# Altium project Ticket_Dispancer.PrjPcb (part 3 of 3)

## Sheet Power.SchDoc
size A4; SheetNumber: 7; SheetTotal: 8
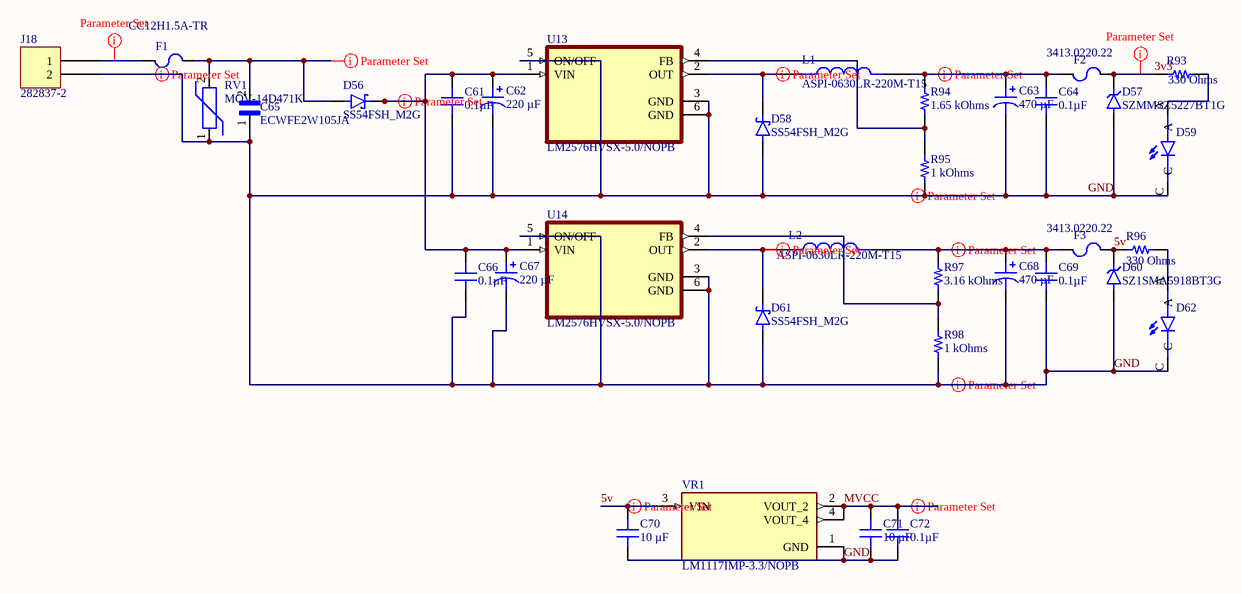
[diagram p6: Power.SchDoc]

### Parts
C61  Capacitance: 0.1µF  [CAP 0805_2012]  (hidden comment: 1µF)
C62  220 µF  [CAP ALSMD ELEC 8.3MM H11MM]
C63  470 µF  [CAP ALSMD 8.3MM H10.5MM]
C64  Capacitance: 0.1µF  [CAP 0805_2012]  (hidden comment: 1µF)
C65  ECWFE2W105JA  [CAPRR1500W80L1750T700H1250]
C66  Capacitance: 0.1µF  [CAP 0805_2012]  (hidden comment: 1µF)
C67  220 µF  [CAP ALSMD ELEC 8.3MM H11MM]
C68  470 µF  [CAP ALSMD 8.3MM H10.5MM]
C69  Capacitance: 0.1µF  [CAP 0805_2012]  (hidden comment: 1µF)
C70  10 µF  [MURATA CAP GRM31C 1206_3216]
C71  10 µF  [MURATA CAP GRM31C 1206_3216]
C72  Capacitance: 0.1µF  [CAP 0805_2012]  (hidden comment: 1µF)
D56  SS54FSH_M2G  [SODFL4725X110N]
D57  SZMMSZ5227BT1G  [DIO_SZMMSZ5227BT1G]
D58  SS54FSH_M2G  [SODFL4725X110N]
D59  597-3305-607F  [LEDC2012X70N]  (value not drawn)
D60  SZ1SMA5918BT3G  [DIOM5226X220N]
D61  SS54FSH_M2G  [SODFL4725X110N]
D62  597-3305-607F  [LEDC2012X70N]  (value not drawn)
F1  CC12H1.5A-TR  [FUSE 1206_3216 0.6MM]
F2  3413.0220.22  [FUSE 1206_3216 0.6MM]
F3  3413.0220.22  [FUSE 1206_3216 0.6MM]
J18  282837-2  [TE 282837-2]
L1  ASPI-0630LR-220M-T15  [IND_ASPI-0630LR-220M-T15]
L2  ASPI-0630LR-220M-T15  [IND_ASPI-0630LR-220M-T15]
R93  330 Ohms  [RES 0805_2012]
R94  1.65 kOhms  [RES 0805_2012]
R95  1 kOhms  [RES 0805_2012]
R96  330 Ohms  [RES 0805_2012]
R97  3.16 kOhms  [RES 0805_2012]
R98  1 kOhms  [RES 0805_2012]
RV1  MOV-14D471K  [MOV14D471K]
U13  LM2576HVSX-5.0/NOPB  [VREG_TPS79625KTTR]
U14  LM2576HVSX-5.0/NOPB  [VREG_TPS79625KTTR]
VR1  LM1117IMP-3.3/NOPB  [VREG_LM1117IMP-3.3/NOPB]

### Nets
3v3: D57.1(K) F2.2 R93.1
5v: C70.2 D60.C F3.2 R96.1 VR1.3(VIN)
GND: C61.1 C62.2 C63.2 C64.1 C65.1 C66.1 C67.2 C68.2 C69.1 C70.1 C71.1 C72.1 D57.2(A) D58.A D59.C D60.A D61.A D62.C J18.2 R95.2 R98.2 RV1.1 U13.3(GND) U13.5(ON/OFF) U13.6(GND) U14.3(GND) U14.5(ON/OFF) U14.6(GND) VR1.1(GND)
MVCC: C71.2 C72.2 VR1.2(VOUT_2) VR1.4(VOUT_4)
NetC61_2: C61.2 C62.1 C66.2 C67.1 D56.C(K) U13.1(VIN) U14.1(VIN)
NetC63_1: C63.1 C64.2 F2.1 L1.2 R94.1
NetC65_2: C65.2 D56.A F1.2 RV1.2
NetC68_1: C68.1 C69.2 F3.1 L2.2 R97.2
NetD58_C: D58.C(K) L1.1 U13.2(OUT)
NetD59_A: D59.A R93.2
NetD61_C: D61.C(K) L2.1 U14.2(OUT)
NetD62_A: D62.A R96.2
NetF1_1: F1.1 J18.1
NetR94_2: R94.2 R95.1 U13.4(FB)
NetR97_1: R97.1 R98.1 U14.4(FB)

### Layout directives
net class High_current: GND, NetC61_2, NetC63_1, NetC65_2, NetC68_1, NetD58_C, NetD61_C, NetF1_1
net class power: 3v3, 5v, GND, MVCC

### Library data of the parts
C61 C64 C66 C69 C72 = 0805ZC105KAT4A: CAP CER 1UF 10V X7R 0805; manufacturer: AVX Corporation; Tolerance: ±10%; Part Number: 0805ZC105KAT4A; Applications: General Purpose; componentlink1description: Datasheet; componentlink1url: http://datasheets.avx.com/X7RDielectric.pdf; componentlink2description: DigiKey Link; componentlink2url: http://digikey.com/product-detail/en/avx-corporation/0805ZC105KAT4A/478-7604-1-ND/7536237; Device Package: 0805 (2012 Metric); lastupdated: 02-09-2020 1.04.40 AM; Lifecycle Status: Active; Minimum Order: 1; Mounting Type: Surface Mount, MLCC; Operating Temperature: -55°C ~ 125°C; Package / Case: 0805 (2012 Metric); packaging: TapeAndReel; partid: 3500; Part Status: Active; price: 0.17; series: -; Size / Dimension: 0.079" L x 0.049" W (2.00mm x 1.25mm); Supplier 1: DigiKey; Supplier Part Number 1: 478-7604-1-ND; Temperature Coefficient: X7R; Thickness (Max): 0.037" (0.94mm); value: 1µF; Voltage - Rated: 10V
C62 C67 = UCH1V221MCS1GS: CAP ALUM 220UF 20% 35V SMD; manufacturer: Nichicon; ESR (Equivalent Series Resistance): 200mOhm @ 100kHz; Lifetime @ Temp.: 2000 Hrs @ 125°C; Polarization: Polar; Ripple Current @ High Frequency: 270 mA @ 100 kHz; Ripple Current @ Low Frequency: 135 mA @ 120 Hz; Surface Mount Land Size: 0.327" L x 0.327" W (8.30mm x 8.30mm); Part Number: UCH1V221MCS1GS; Applications: Automotive; Capacitance: 220 µF; componentlink1description: Datasheet; componentlink1url: https://www.nichicon.co.jp/english/series_items/catalog_pdf/e-uch.pdf; componentlink2description: DigiKey Link; componentlink2url: https://www.digikey.com/en/products/detail/nichicon/UCH1V221MCS1GS/13402772; Height - Seated (Max): 0.433" (11.00mm); lastupdated: 03-06-2024 8.26.59 PM; Lifecycle Status: Active; Minimum Order: 1; Mounting Type: Surface Mount; Operating Temperature: -40°C ~ 125°C; packaging: TapeAndReel; partid: 28619; price: 0.47; Ratings: AEC-Q200; series: UCH; Size / Dimension: 0.315" Dia (8.00mm); Supplier 1: DigiKey; Supplier Part Number 1: UCH1V221MCS1CT-ND; Tolerance: ±20%; value: 220 µF; Voltage - Rated: 35 V
C63 C68 = EMZL100ARA471MHA0G: CAP ALUM 470UF 20% 10V SMD; manufacturer: Chemi-Con; ESR (Equivalent Series Resistance): 160mOhm @ 100kHz; Lifetime @ Temp.: 5000 Hrs @ 105°C; Polarization: Polar; Ripple Current @ High Frequency: 600 mA @ 100 kHz; Ripple Current @ Low Frequency: 300 mA @ 120 Hz; Surface Mount Land Size: 0.327" L x 0.327" W (8.30mm x 8.30mm); Part Number: EMZL100ARA471MHA0G; Applications: Automotive; Capacitance: 470 µF; componentlink1description: Datasheet; componentlink1url: https://www.chemi-con.co.jp/products/relatedfiles/capacitor/catalog/MZLRA-e.PDF; componentlink2description: DigiKey Link; componentlink2url: https://www.digikey.com/en/products/detail/chemi-con/EMZL100ARA471MHA0G/17728433; Height - Seated (Max): 0.413" (10.50mm); lastupdated: 03-06-2024 8.15.40 PM; Lifecycle Status: Active; Minimum Order: 1; Mounting Type: Surface Mount; Operating Temperature: -55°C ~ 105°C; packaging: TapeAndReel; partid: 28535; price: 0.15; Ratings: AEC-Q200; series: Alchip™- MZL; Size / Dimension: 0.315" Dia (8.00mm); Supplier 1: DigiKey; Supplier Part Number 1: 565-EMZL100ARA471MHA0GCT-ND; Tolerance: ±20%; value: 470 µF; Voltage - Rated: 10 V
C70 C71 = GRM31CR71E106KA12K: CAP CER 10UF 25V X7R 1206; manufacturer: Murata Electronics; Tolerance: ±10%; Part Number: GRM31CR71E106KA12K; Capacitance: 10 µF; Applications: General Purpose; componentlink1description: Datasheet; componentlink1url: https://search.murata.co.jp/Ceramy/image/img/A01X/G101/ENG/GRM31CR71E106KA12-01.pdf; componentlink2description: DigiKey Link; componentlink2url: https://www.digikey.com/en/products/detail/murata-electronics/GRM31CR71E106KA12K/4905618; Device Package: 1206 (3216 Metric); lastupdated: 29-03-2026 9.05.15 PM; Lifecycle Status: Active; Minimum Order: 1; Mounting Type: Surface Mount, MLCC; Operating Temperature: -55°C ~ 125°C; Package / Case: 1206 (3216 Metric); packaging: TapeAndReel; partid: 19493; Part Status: Active; price: 0.07; series: GRM; Size / Dimension: 0.126" L x 0.063" W (3.20mm x 1.60mm); Supplier 1: DigiKey; Supplier Part Number 1: 490-14678-1-ND; Temperature Coefficient: X7R; Thickness (Max): 0.071" (1.80mm); value: 10 µF; Voltage - Rated: 25V
D56 D58 D61 = SS54FSH_M2G: Schottky Diodes & Rectifiers 5A, 40V, Schottky Rectifier; MF: Taiwan Semiconductor; MP: SS54FSH M2G; SnapEDA_Link: https://www.snapeda.com/parts/SS54FSH%20M2G/taiwan/view-part/?ref=snap; Package: None; Value: *; Check_prices: https://www.snapeda.com/parts/SS54FSH%20M2G/taiwan/view-part/?ref=eda
D59 D62 = 597-3305-607F: LED Uni-Color Green 4-Pin Chip 0805 T/R; Availability: Unavailable; Value: *; Price: None; MP: 597-3305-607F; Package: None
D60 = SZ1SMA5918BT3G: Zener Diode 5.1 V 1.5 W Â±5% Surface Mount SMA; MF: ON Semiconductor; SnapEDA_Link: https://www.snapeda.com/parts/SZ1SMA5918BT3G/Onsemi/view-part/?ref=snap; Package: SMA-2 ON Semiconductor; Value: *; MP: SZ1SMA5918BT3G; Check_prices: https://www.snapeda.com/parts/SZ1SMA5918BT3G/Onsemi/view-part/?ref=eda
F1 = CC12H1.5A-TR: FUSE BOARD MOUNT 1.5A 63VDC 1206; Manufacturer: Eaton - Electronics Division; Approval Agency: cURus; Breaking Capacity @ Rated Voltage: 50A; Fuse Type: Board Mount (Cartridge Style Excluded); Melting I²t: 0.4; Response Time: Slow Blow; Voltage Rating - DC: 63V; Part Number: CC12H1.5A-TR; Approvals: cURus; ComponentLink1Description: Datasheet; ComponentLink1URL: http://www.cooperindustries.com/content/dam/public/bussmann/Electronics/Resources/product-datasheets/Bus_Elx_DS_4309_CC12H_Series.pdf; ComponentLink2Description: DigiKey Link; ComponentLink2URL: http://digikey.com/product-detail/en/eaton-electronics-division/CC12H1.5A-TR/283-2979-1-ND/2138910; Current Rating (Amps): 1.5A; Device Package: 1206 (3216 Metric); LastUpdated: 02-09-2020 1.30.41 AM; Lifecycle Status: Active; Minimum Order: 1; Mounting Type: Surface Mount; Operating Temperature: -55°C ~ 125°C; Package / Case: 1206 (3216 Metric); Packaging: TapeAndReel; Part Status: Active; Price: 0.39; Series: CC12H; Size / Dimension: 0.126" L x 0.063" W x 0.024" H (3.20mm x 1.60mm x 0.60mm); Supplier 1: DigiKey; Supplier Part Number 1: 283-2979-1-ND
F2 F3 = 3413.0220.22: FUSE BOARD MNT 2.5A 32VAC 63VDC; Manufacturer: Schurter Inc.; Approval Agency: cURus, VDE; Breaking Capacity @ Rated Voltage: 63A; Fuse Type: Board Mount (Cartridge Style Excluded); Melting I²t: 0.94; Response Time: Fast Blow; Voltage Rating - AC: 32V; Voltage Rating - DC: 63V; Part Number: 3413.0220.22; Approvals: cURus, VDE; ComponentLink1Description: Datasheet; ComponentLink1URL: https://us.schurter.com/pdf/english/typ_USI_1206.pdf; ComponentLink2Description: DigiKey Link; ComponentLink2URL: http://digikey.com/product-detail/en/schurter-inc/3413.0220.22/486-1148-1-ND/1522980; Current Rating (Amps): 2.5A; Device Package: 1206 (3216 Metric); LastUpdated: 02-09-2020 1.30.41 AM; Lifecycle Status: Active; Minimum Order: 1; Mounting Type: Surface Mount; Operating Temperature: -55°C ~ 90°C; Package / Case: 1206 (3216 Metric); Packaging: TapeAndReel; Part Status: Active; Price: 0.26; Series: USI 1206; Size / Dimension: 0.126" L x 0.063" W x 0.024" H (3.20mm x 1.60mm x 0.60mm); Supplier 1: DigiKey; Supplier Part Number 1: 486-1148-1-ND
J18 = 282837-2: TERM BLK 2P SIDE ENT 5.08MM PCB; Manufacturer: TE Connectivity AMP Connectors; Current: 13.5 A; Mating Orientation: Horizontal with Board; Number of Levels: 1; Pitch: 0.200" (5.08mm); Positions Per Level: 2; Voltage: 300 V; Wire Gauge: 16-28 AWG; Wire Termination: Screw - Rising Cage Clamp; Part Number: 282837-2; Color: Green; ComponentLink1Description: Datasheet; ComponentLink1URL: https://www.te.com/commerce/DocumentDelivery/DDEController?Action=srchrtrv&DocNm=282837&DocType=Customer+Drawing&DocLang=English; ComponentLink2Description: DigiKey Link; ComponentLink2URL: https://www.digikey.com/en/products/detail/te-connectivity-amp-connectors/282837-2/2187973; Features: Interlocking (Side); LastUpdated: 21-06-2022 3.00.23 PM; Lifecycle Status: Active; Minimum Order: 1; Mounting Type: Through Hole; Packaging: Tray; Part Status: Active; Price: 0.31; Series: Buchanan; Supplier 1: DigiKey; Supplier Part Number 1: A113320-ND
L1 L2 = ASPI-0630LR-220M-T15: MF: {'manufacturer': u'Abracon LLC'}; Price: None; Package: None; MP: ASPI-0630LR-220M-T15; Availability: Unavailable; Value: *
R93 R96 = ERJ-PB6B3300V: RES SMD 330 OHM 0.1% 1/4W 0805; Manufacturer: Panasonic Electronic Components; Power (Watts): 0.25W, 1/4W; Temperature Coefficient: ±50ppm/°C; Part Number: ERJ-PB6B3300V; Value: 330 Ohms; ComponentLink1Description: Datasheet; ComponentLink1URL: https://industrial.panasonic.com/cdbs/www-data/pdf/RDM0000/AOA0000C328.pdf; ComponentLink2Description: DigiKey Link; ComponentLink2URL: https://www.digikey.com/en/products/detail/panasonic-electronic-components/ERJ-PB6B3300V/6213320; Composition: Thick Film; Device Package: 0805 (2012 Metric); Features: Automotive AEC-Q200, Pulse Withstanding; Height - Seated (Max): 0.028" (0.70mm); LastUpdated: 08-02-2024 9.02.05 PM; Lifecycle Status: Active; Minimum Order: 1; Number of Terminations: 2; Operating Temperature: -55°C ~ 155°C; Package / Case: 0805 (2012 Metric); Packaging: TapeAndReel; PartId: 35583; Part Status: Active; Price: 0.04; Ratings: AEC-Q200; Resistance: 330 Ohms; Series: ERJ-PB6; Size / Dimension: 0.079" L x 0.049" W (2.00mm x 1.25mm); Supplier 1: DigiKey; Supplier Part Number 1: P20537CT-ND; Supplier Device Package: 0805; Tolerance: ±0.1%
R94 = KTR10EZPF1651: RES SMD 1.65K OHM 1% 1/8W 0805; Manufacturer: Rohm Semiconductor; Power (Watts): 0.125W, 1/8W; Temperature Coefficient: ±100ppm/°C; Part Number: KTR10EZPF1651; Value: 1.65 kOhms; ComponentLink1Description: Datasheet; ComponentLink1URL: https://www.rohm.com/datasheet/KTR03EZPF/ktr-e; ComponentLink2Description: DigiKey Link; ComponentLink2URL: https://www.digikey.com/en/products/detail/rohm-semiconductor/KTR10EZPF1651/4051813; Composition: Thick Film; Device Package: 0805 (2012 Metric); Features: Automotive AEC-Q200, High Voltage; Height - Seated (Max): 0.026" (0.65mm); LastUpdated: 08-02-2024 9.02.33 PM; Lifecycle Status: Active; Minimum Order: 1; Number of Terminations: 2; Operating Temperature: -55°C ~ 155°C; Package / Case: 0805 (2012 Metric); Packaging: TapeAndReel; PartId: 29062; Part Status: Active; Price: 0.02; Ratings: AEC-Q200; Resistance: 1.65 kOhms; Series: KTR; Size / Dimension: 0.079" L x 0.049" W (2.00mm x 1.25mm); Supplier 1: DigiKey; Supplier Part Number 1: RHM1.65KAHCT-ND; Supplier Device Package: 0805; Tolerance: ±1%
R95 R98 = ESR10EZPF1001: RES SMD 1K OHM 1% 0.4W 0805; Manufacturer: Rohm Semiconductor; Power (Watts): 0.4W, 2/5W; Temperature Coefficient: ±100ppm/°C; Part Number: ESR10EZPF1001; Value: 1 kOhms; ComponentLink1Description: Datasheet; ComponentLink1URL: https://www.rohm.com/datasheet/ESR01MZPF/esr-e; ComponentLink2Description: DigiKey Link; ComponentLink2URL: https://www.digikey.com/en/products/detail/rohm-semiconductor/ESR10EZPF1001/1983480; Composition: Thick Film; Device Package: 0805 (2012 Metric); Features: Automotive AEC-Q200, Pulse Withstanding; Height - Seated (Max): 0.026" (0.65mm); LastUpdated: 08-02-2024 9.02.37 PM; Lifecycle Status: Active; Minimum Order: 1; Number of Terminations: 2; Operating Temperature: -55°C ~ 155°C; Package / Case: 0805 (2012 Metric); Packaging: TapeAndReel; PartId: 28032; Part Status: Active; Price: 0.02; Ratings: AEC-Q200; Resistance: 1 kOhms; Series: ESR; Size / Dimension: 0.079" L x 0.049" W (2.00mm x 1.25mm); Supplier 1: DigiKey; Supplier Part Number 1: RHM1.00KAECT-ND; Supplier Device Package: 0805; Tolerance: ±1%
R97 = CRCW08053K16FKEA: RES SMD 3.16K OHM 1% 1/8W 0805; Manufacturer: Vishay Dale; Power (Watts): 0.125W, 1/8W; Temperature Coefficient: ±100ppm/°C; Part Number: CRCW08053K16FKEA; Value: 3.16 kOhms; ComponentLink1Description: Datasheet; ComponentLink1URL: http://www.vishay.com/docs/20035/dcrcwe3.pdf; ComponentLink2Description: DigiKey Link; ComponentLink2URL: https://www.digikey.com/en/products/detail/vishay-dale/CRCW08053K16FKEA/1175692; Composition: Thick Film; Device Package: 0805 (2012 Metric); Features: Automotive AEC-Q200; Height - Seated (Max): 0.020" (0.50mm); LastUpdated: 08-02-2024 9.02.17 PM; Lifecycle Status: Active; Minimum Order: 1; Number of Terminations: 2; Operating Temperature: -55°C ~ 155°C; Package / Case: 0805 (2012 Metric); Packaging: TapeAndReel; PartId: 32701; Part Status: Active; Price: 0.01; Ratings: AEC-Q200; Resistance: 3.16 kOhms; Series: CRCW; Size / Dimension: 0.079" L x 0.049" W (2.00mm x 1.25mm); Supplier 1: DigiKey; Supplier Part Number 1: 541-3.16KCCT-ND; Supplier Device Package: 0805; Tolerance: ±1%
RV1 = MOV-14D471K: 470 V 4.5 kA Varistor 1 Circuit Through Hole Disc 14mm; MF: Bourns; SnapEDA_Link: https://www.snapeda.com/parts/MOV-14D471K/Bourns/view-part/?ref=snap; Check_prices: https://www.snapeda.com/parts/MOV-14D471K/Bourns/view-part/?ref=eda; Value: *; Purchase-URL: https://pricing.snapeda.com/search/part/MOV-14D471K/?ref=eda; Availability: In Stock; MP: MOV-14D471K; Price: None; Package: Disc-14 Bourns
U13 U14 = LM2576HVSX-5.0/NOPB: SIMPLE SWITCHERÂ® 4V to 60V, 3A Low Component Count Step-Down Regulator; MF: Texas Instruments; SnapEDA_Link: https://www.snapeda.com/parts/LM2576HVSX-5.0/NOPB/Texas+Instruments/view-part/?ref=snap; Package: TO-263-5 Texas Instruments; Value: *; MP: LM2576HVSX-5.0/NOPB; Check_prices: https://www.snapeda.com/parts/LM2576HVSX-5.0/NOPB/Texas+Instruments/view-part/?ref=eda
VR1 = LM1117IMP-3.3/NOPB: 800-mA 15-V linear voltage regulator; MF: Texas Instruments; SnapEDA_Link: https://www.snapeda.com/parts/LM1117IMP-3.3/NOPB/Texas+Instruments/view-part/?ref=snap; Package: SOT-223-4 Texas Instruments; Value: *; MP: LM1117IMP-3.3/NOPB; Check_prices: https://www.snapeda.com/parts/LM1117IMP-3.3/NOPB/Texas+Instruments/view-part/?ref=eda
C65 = ECWFE2W105JA: Value: *; Price: None; Availability: Unavailable; Package: None; MP: ECWFE2W105JA
D57 = SZMMSZ5227BT1G: Package: None; Price: None; Value: *; MP: SZMMSZ5227BT1G; Availability: Unavailable

## Sheet Usb.SchDoc
size A4; SheetNumber: 8; SheetTotal: 8
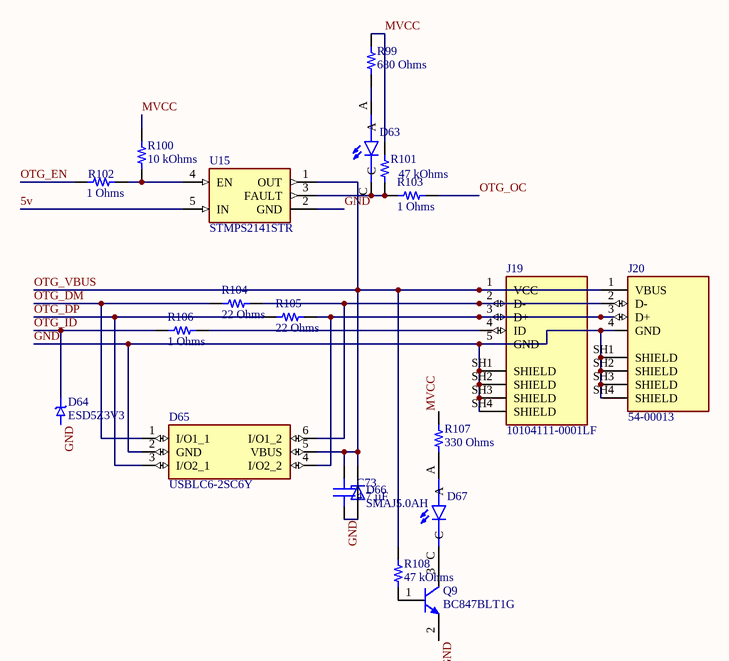
[diagram p7: Usb.SchDoc]

### Parts
C73  4.7 µF  [CAP 0805_2012]
D63  597-3305-607F  [LEDC2012X70N]  (value not drawn)
D64  ESD5Z3V3  [SOD-523_DIOTEC-SEMICONDUCTOR]
D65  USBLC6-2SC6Y  [SOT95P280X145-6N]
D66  SMAJ5.0AH  [DIOM4325X250N]
D67  597-3305-607F  [LEDC2012X70N]  (value not drawn)
J19  10104111-0001LF  [AMPHENOL_10104111-0001LF]
J20  54-00013  [TENSILITY_54-00013]
Q9  BC847BLT1G  [ON SEMI SOT-23-3]
R99  680 Ohms  [RES 0805_2012]
R100  10 kOhms  [YAGEO RES 0805_2012]
R101  47 kOhms  [YAGEO RES 0805_2012]
R102  1 Ohms  [RES 0805_2012]
R103  1 Ohms  [RES 0805_2012]
R104  22 Ohms  [RES 0805_2012]
R105  22 Ohms  [RES 0805_2012]
R106  1 Ohms  [RES 0805_2012]
R107  330 Ohms  [RES 0805_2012]
R108  47 kOhms  [YAGEO RES 0805_2012]
U15  STMPS2141STR  [SOT95P280X145-5N]

### Nets
5v: U15.5(IN)
GND: C73.1 D64.2(A) D65.2(GND) D66.A J19.5(GND) J19.SH1(SHIELD) J19.SH2(SHIELD) J19.SH3(SHIELD) J19.SH4(SHIELD) J20.4(GND) J20.SH1(SHIELD) J20.SH2(SHIELD) J20.SH3(SHIELD) J20.SH4(SHIELD) Q9.2(E) U15.2(GND)
MVCC: R99.2 R100.2 R101.2 R107.2
OTG_DM: D65.1(I/O1_1) R104.1
OTG_DP: D65.3(I/O2_1) R105.1
OTG_EN: R102.1
OTG_ID: D64.1(C) R106.1
OTG_OC: R103.2
OTG_VBUS: C73.2 D65.5(VBUS) D66.C J19.1(VCC) J20.1(VBUS) R108.2 U15.1(OUT)
NetD63_A: D63.A R99.1
NetD63_C: D63.C R101.1 R103.1 U15.3(FAULT)
NetD65_4: D65.4(I/O2_2) J19.3(D+) J20.3(D+) R105.2
NetD65_6: D65.6(I/O1_2) J19.2(D-) J20.2(D-) R104.2
NetD67_A: D67.A R107.1
NetD67_C: D67.C Q9.3(C)
NetJ19_4: J19.4(ID) R106.2
NetQ9_1: Q9.1(B) R108.1
NetR100_1: R100.1 R102.2 U15.4(EN)

### Library data of the parts
C73 = C0805X475M3RAC7800: 4.70UF 25.0V; manufacturer: KEMET; Temperature Coefficient: X7R; Tolerance: ±20%; Voltage - Rated: 25V; Part Number: C0805X475M3RAC7800; Capacitance: 4.7 µF; Applications: Boardflex Sensitive; componentlink1description: Datasheet; componentlink1url: https://connect.kemet.com:7667/gateway/IntelliData-ComponentDocumentation/1.0/download/datasheet/C0805X475M3RAC7800; componentlink2description: DigiKey Link; componentlink2url: https://www.digikey.com/en/products/detail/kemet/C0805X475M3RAC7800/12082671; Device Package: 0805 (2012 Metric); Features: Soft Termination; lastupdated: 29-03-2026 7.18.51 PM; Lifecycle Status: Active; Minimum Order: 1; Mounting Type: Surface Mount, MLCC; Operating Temperature: -55°C ~ 125°C; Package / Case: 0805 (2012 Metric); packaging: TapeAndReel; partid: 46494; Part Status: Active; price: 0.15; series: SMD Comm X7R Flex; Size / Dimension: 0.079" L x 0.049" W (2.00mm x 1.25mm); Supplier 1: DigiKey; Supplier Part Number 1: 399-C0805X475M3RAC7800CT-ND; Thickness (Max): 0.057" (1.45mm); value: 4.7 µF
D63 D67 = 597-3305-607F: LED Uni-Color Green 4-Pin Chip 0805 T/R; Availability: Unavailable; Value: *; Price: None; MP: 597-3305-607F; Package: None
D64 = ESD5Z3V3: ESD, SOD-523, 0.05ÂµA, 3.3V, Unidir; MF: Diotec Semiconductor; SnapEDA_Link: https://www.snapeda.com/parts/ESD5Z3V3/Diotec/view-part/?ref=snap; Package: SOD-523 Diotec; Value: *; MP: ESD5Z3V3; Check_prices: https://www.snapeda.com/parts/ESD5Z3V3/Diotec/view-part/?ref=eda
D65 = USBLC6-2SC6Y: 17V Clamp 5A (8/20µs) Ipp Tvs Diode Surface Mount SOT-23-6; MF: STMicroelectronics; SnapEDA_Link: https://www.snapeda.com/parts/USBLC6-2SC6Y/STMicroelectronics/view-part/?ref=snap; Package: SOT-23-6 STMicroelectronics; Value: *; MP: USBLC6-2SC6Y; Check_prices: https://www.snapeda.com/parts/USBLC6-2SC6Y/STMicroelectronics/view-part/?ref=eda
J19 = 10104111-0001LF: Conn Data USB TypeAB Socket 5Cnts RightAngle Micro SMT | Amphenol FCI (Amphenol CS) 10104111-0001LF; SnapEDA_Link: https://www.snapeda.com/parts/10104111-0001LF/Amphenol/view-part/?ref=snap; Package: None; Value: *; MF: Amphenol; MP: 10104111-0001LF; Check_prices: https://www.snapeda.com/parts/10104111-0001LF/Amphenol/view-part/?ref=eda
J20 = 54-00013: Connector, USB A Jack, PCB side-mount, 90 degrees, nickel shell, board lock, black insulator, tray; MF: Tensility International Corporation; SnapEDA_Link: https://www.snapeda.com/parts/54-00013/Tensility/view-part/?ref=snap; Package: None; Value: *; MP: 54-00013; Check_prices: https://www.snapeda.com/parts/54-00013/Tensility/view-part/?ref=eda
Q9 = BC847BLT1G: TRANS NPN 45V 0.1A SOT23; Manufacturer: ON Semiconductor; Current - Collector Cutoff (Max): 15nA (ICBO); Current - Collector (Ic) (Max): 100mA; DC Current Gain (hFE) (Min) @ Ic, Vce: 200 @ 2mA, 5V; Frequency - Transition: 100MHz; Power - Max: 300mW; Vce Saturation (Max) @ Ib, Ic: 600mV @ 5mA, 100mA; Part Number: BC847BLT1G; ComponentLink1Description: Datasheet; ComponentLink1URL: http://www.onsemi.com/pub/Collateral/BC846ALT1-D.PDF; ComponentLink2Description: DigiKey Link; ComponentLink2URL: http://digikey.com/product-detail/en/on-semiconductor/BC847BLT1G/BC847BLT1GOSCT-ND/917834; LastUpdated: 29-03-2026 8.43.49 PM; Lifecycle Status: Active; Minimum Order: 1; Mounting Type: Surface Mount; Operating Temperature: -55°C ~ 150°C (TJ); Package / Case: TO-236-3, SC-59, SOT-23-3; Packaging: TapeAndReel; PartId: 246; Part Status: Active; Price: 0.02; Series: -; Supplier 1: DigiKey; Supplier Part Number 1: BC847BLT1GOSCT-ND; Supplier Device Package: SOT-23-3 (TO-236); Transistor Type: NPN; Voltage - Collector Emitter Breakdown (Max): 45V
R99 = RNCF0805DTE680R: RES SMD 680 OHM 0.5% 1/4W 0805; Manufacturer: Stackpole Electronics Inc; Power (Watts): 0.25W, 1/4W; Temperature Coefficient: ±25ppm/°C; Part Number: RNCF0805DTE680R; Value: 680 Ohms; ComponentLink1Description: Datasheet; ComponentLink1URL: https://www.seielect.com/catalog/sei-rncf.pdf; ComponentLink2Description: DigiKey Link; ComponentLink2URL: https://www.digikey.com/en/products/detail/stackpole-electronics-inc/RNCF0805DTE680R/6241785; Composition: Thin Film; Device Package: 0805 (2012 Metric); Features: Automotive AEC-Q200; Height - Seated (Max): 0.026" (0.65mm); LastUpdated: 30-03-2026 8.13.21 PM; Lifecycle Status: Active; Minimum Order: 1; Number of Terminations: 2; Operating Temperature: -55°C ~ 155°C; Package / Case: 0805 (2012 Metric); Packaging: TapeAndReel; PartId: 28010; Part Status: Active; Price: 0.01; Ratings: AEC-Q200; Resistance: 680 Ohms; Series: RNCF; Size / Dimension: 0.079" L x 0.049" W (2.00mm x 1.25mm); Supplier 1: DigiKey; Supplier Part Number 1: 738-RNCF0805DTE680RCT-ND; Supplier Device Package: 0805; Tolerance: ±0.5%
R100 = RT0805DRD0710KL: RES SMD 10K OHM 0.5% 1/8W 0805; Manufacturer: Yageo; Power (Watts): 0.125W, 1/8W; Temperature Coefficient: ±25ppm/°C; Part Number: RT0805DRD0710KL; Value: 10 kOhms; ComponentLink1Description: Datasheet; ComponentLink1URL: https://www.yageo.com/upload/media/product/productsearch/datasheet/rchip/PYu-RT_1-to-0.01_RoHS_L_11.pdf; ComponentLink2Description: DigiKey Link; ComponentLink2URL: https://www.digikey.com/en/products/detail/yageo/RT0805DRD0710KL/1077814; Composition: Thin Film; Device Package: 0805 (2012 Metric); Height - Seated (Max): 0.024" (0.60mm); LastUpdated: 30-03-2026 9.20.29 PM; Lifecycle Status: Active; Minimum Order: 1; Number of Terminations: 2; Operating Temperature: -55°C ~ 155°C; Package / Case: 0805 (2012 Metric); Packaging: TapeAndReel; PartId: 27797; Part Status: Active; Price: 0.02; Resistance: 10 kOhms; Series: RT; Size / Dimension: 0.079" L x 0.049" W (2.00mm x 1.25mm); Supplier 1: DigiKey; Supplier Part Number 1: 311-2699-1-ND; Supplier Device Package: 0805; Tolerance: ±0.5%
R101 R108 = RT0805DRD0747KL: RES SMD 47K OHM 0.5% 1/8W 0805; Manufacturer: Yageo; Power (Watts): 0.125W, 1/8W; Temperature Coefficient: ±25ppm/°C; Part Number: RT0805DRD0747KL; Value: 47 kOhms; ComponentLink1Description: Datasheet; ComponentLink1URL: https://www.yageo.com/upload/media/product/productsearch/datasheet/rchip/PYu-RT_1-to-0.01_RoHS_L_11.pdf; ComponentLink2Description: DigiKey Link; ComponentLink2URL: https://www.digikey.com/en/products/detail/yageo/RT0805DRD0747KL/1078180; Composition: Thin Film; Device Package: 0805 (2012 Metric); Height - Seated (Max): 0.024" (0.60mm); LastUpdated: 30-03-2026 9.20.29 PM; Lifecycle Status: Active; Minimum Order: 1; Number of Terminations: 2; Operating Temperature: -55°C ~ 155°C; Package / Case: 0805 (2012 Metric); Packaging: TapeAndReel; PartId: 27804; Part Status: Active; Price: 0.02; Resistance: 47 kOhms; Series: RT; Size / Dimension: 0.079" L x 0.049" W (2.00mm x 1.25mm); Supplier 1: DigiKey; Supplier Part Number 1: 311-2747-1-ND; Supplier Device Package: 0805; Tolerance: ±0.5%
R102 R103 R106 = CSR0805FK1R00: RES 1 OHM 1% 1/4W 0805; Manufacturer: Stackpole Electronics Inc; Power (Watts): 0.25W, 1/4W; Temperature Coefficient: ±200ppm/°C; Part Number: CSR0805FK1R00; Value: 1 Ohms; ComponentLink1Description: Datasheet; ComponentLink1URL: https://www.seielect.com/catalog/sei-csr_csrn.pdf; ComponentLink2Description: DigiKey Link; ComponentLink2URL: https://www.digikey.com/en/products/detail/stackpole-electronics-inc/CSR0805FK1R00/2217466; Composition: Thick Film; Device Package: 0805 (2012 Metric); Features: Current Sense; Height - Seated (Max): 0.026" (0.65mm); LastUpdated: 30-03-2026 8.13.19 PM; Lifecycle Status: Active; Minimum Order: 1; Number of Terminations: 2; Operating Temperature: -55°C ~ 155°C; Package / Case: 0805 (2012 Metric); Packaging: TapeAndReel; PartId: 28379; Part Status: Active; Price: 0.03; Resistance: 1 Ohms; Series: CSR; Size / Dimension: 0.079" L x 0.049" W (2.00mm x 1.25mm); Supplier 1: DigiKey; Supplier Part Number 1: CSR0805FK1R00CT-ND; Supplier Device Package: 0805; Tolerance: ±1%
R104 R105 = CRGH0805J22R: RES 22 OHM 5% 1/3W 0805; Manufacturer: TE Connectivity Passive Product; Power (Watts): 0.333W, 1/3W; Temperature Coefficient: ±100ppm/°C; Part Number: CRGH0805J22R; Value: 22 Ohms; ComponentLink1Description: Datasheet; ComponentLink1URL: https://www.te.com/commerce/DocumentDelivery/DDEController?Action=srchrtrv&DocNm=1773204-1&DocType=DS&DocLang=English; ComponentLink2Description: DigiKey Link; ComponentLink2URL: https://www.digikey.com/en/products/detail/te-connectivity-passive-product/CRGH0805J22R/2385484; Composition: Thick Film; Device Package: 0805 (2012 Metric); Features: Automotive AEC-Q200; LastUpdated: 30-03-2026 8.13.21 PM; Lifecycle Status: Active; Minimum Order: 1; Number of Terminations: 2; Operating Temperature: -55°C ~ 155°C; Package / Case: 0805 (2012 Metric); Packaging: TapeAndReel; PartId: 28124; Part Status: Active; Price: 0.01; Ratings: AEC-Q200; Resistance: 22 Ohms; Series: CRGH, Neohm; Size / Dimension: 0.079" L x 0.049" W (2.00mm x 1.25mm); Supplier 1: DigiKey; Supplier Part Number 1: A126437CT-ND; Supplier Device Package: 0805; Tolerance: ±5%
R107 = CRCW0805330RFKEAHP: RES SMD 330 OHM 1% 1/2W 0805; Manufacturer: Vishay Dale; Power (Watts): 0.5W, 1/2W; Temperature Coefficient: ±100ppm/°C; Part Number: CRCW0805330RFKEAHP; Value: 330 Ohms; ComponentLink1Description: Datasheet; ComponentLink1URL: http://www.vishay.com/docs/20043/crcwhpe3.pdf; ComponentLink2Description: DigiKey Link; ComponentLink2URL: https://www.digikey.com/en/products/detail/vishay-dale/CRCW0805330RFKEAHP/2226912; Composition: Thick Film; Device Package: 0805 (2012 Metric); Features: Automotive AEC-Q200, Pulse Withstanding; Height - Seated (Max): 0.024" (0.60mm); LastUpdated: 30-03-2026 8.13.11 PM; Lifecycle Status: Active; Minimum Order: 1; Number of Terminations: 2; Operating Temperature: -55°C ~ 155°C; Package / Case: 0805 (2012 Metric); Packaging: TapeAndReel; PartId: 30364; Part Status: Active; Price: 0.02; Ratings: AEC-Q200; Resistance: 330 Ohms; Series: CRCW-HP e3; Size / Dimension: 0.079" L x 0.049" W (2.00mm x 1.25mm); Supplier 1: DigiKey; Supplier Part Number 1: 541-330TCT-ND; Supplier Device Package: 0805; Tolerance: ±1%
U15 = STMPS2141STR: Power Switch/Driver 1:1 N-Channel 500mA SOT-23-5; MF: STMicroelectronics; MP: STMPS2141STR; Package: SOT-23 STMicroelectronics; Purchase-URL: https://pricing.snapeda.com/search/part/STMPS2141STR/?ref=eda; Check_prices: https://www.snapeda.com/parts/STMPS2141STR/STMicroelectronics/view-part/?ref=eda; Value: *; Digi-Key_Part_Number: 497-6933-2-ND; SnapEDA_Link: https://www.snapeda.com/parts/STMPS2141STR/STMicroelectronics/view-part/?ref=snap
D66 = SMAJ5.0AH: Package: None; Price: None; Value: *; MP: SMAJ5.0AH; Availability: Unavailable

## Nets that join several sheets
3v3: main (J1.9 U2.2), commucation (15 pins), memory (7 pins), LAN (7 pins), DI_DO (15 pins), Power (D57.1 F2.2 R93.1)
5v: main (J4.5), DI_DO (C57.2 C58.2 PS1.1), Relay (15 pins), Power (5 pins), Usb (U15.5)
CLK: main (U1.37), memory (J10.5)
CMD: main (U1.83), memory (J10.3)
D0: main (U1.65), memory (J10.7)
D1: main (U1.35), memory (J10.8)
D2: main (U1.36), memory (J10.1)
D3: main (U1.79), memory (J10.2)
DI1: main (U1.4), DI_DO (D16.4 R39.1)
DI2: main (U1.5), DI_DO (D22.4 R47.1)
DI3: main (U1.7), DI_DO (D28.4 R55.1)
DI4: main (U1.98), DI_DO (D33.4 R60.1)
DI5: main (U1.2), DI_DO (D37.4 R67.1)
DI6: main (U1.3), DI_DO (D42.4 R74.1)
DI7: main (U1.93), DI_DO (D14.4 R36.1)
DI8: main (U1.91), DI_DO (D20.4 R44.1)
DI9: main (U1.89), DI_DO (D26.4 R52.1)
DO1: main (U1.95), DI_DO (R68.1)
DO2: main (U1.96), DI_DO (R78.1)
DO3: main (U1.97), DI_DO (R82.1)
GND: main (31 pins), commucation (37 pins), memory (12 pins), LAN (24 pins), DI_DO (15 pins), Relay (5 pins), Power (29 pins), Usb (16 pins)
IO0: main (U1.58), memory (U9.5)
IO1: main (U1.59), memory (U9.2)
IO2: main (U1.1), memory (U9.3)
IO3: main (U1.60), memory (U9.7)
IO_CLK: main (U1.84), memory (U9.6)
IO_CS: main (U1.92), memory (U9.1)
M_SCL: main (U1.67 U2.3), memory (U10.6 U11.6)
M_SDA: main (U1.66 U2.4), memory (U10.5 U11.5)
MVCC: main (17 pins), Power (C71.2 C72.2 VR1.2 VR1.4), Usb (R99.2 R100.2 R101.2 R107.2)
OTG_DM: main (U1.70), Usb (D65.1 R104.1)
OTG_DP: main (U1.71), Usb (D65.3 R105.1)
OTG_EN: main (U1.61), Usb (R102.1)
OTG_ID: main (U1.69), Usb (D64.1 R106.1)
OTG_OC: main (U1.62), Usb (R103.2)
OTG_VBUS: main (U1.68), Usb (7 pins)
RL1: main (U1.82), Relay (R85.1)
RL2: main (U1.85), Relay (R89.1)
RL3: main (U1.86), Relay (R92.1)
RL4: main (U1.87), Relay (R87.1)
RL5: main (U1.88), Relay (R91.1)
SPI1_CS: main (U1.29), LAN (U12.32)
SPI1_INT: main (U1.33), LAN (U12.36)
SPI1_MISO: main (U1.31), LAN (U12.34)
SPI1_MOSI: main (U1.32), LAN (U12.35)
SPI1_SCK: main (U1.30), LAN (U12.33)
UART2_RX: main (U1.26), commucation (U3.12)
UART2_TX: main (U1.25), commucation (U3.11)
UART3_RX: main (U1.56), commucation (U6.12)
UART3_TX: main (U1.55), commucation (U6.11)
UART4_RX: main (U1.24), commucation (U3.9)
UART4_TX: main (U1.23), commucation (U3.10)
UART5_RX: main (U1.38), commucation (U8.13)
UART5_TX: main (U1.39), commucation (U8.3)
UART6_RX: main (U1.64), commucation (U6.9)
UART6_TX: main (U1.63), commucation (U6.10)
XA: main (U1.40), commucation (U8.10)
XB: main (U1.41), commucation (U8.9)